# Altium schematic sheet SCH.schdoc
size 214 x 385 mm
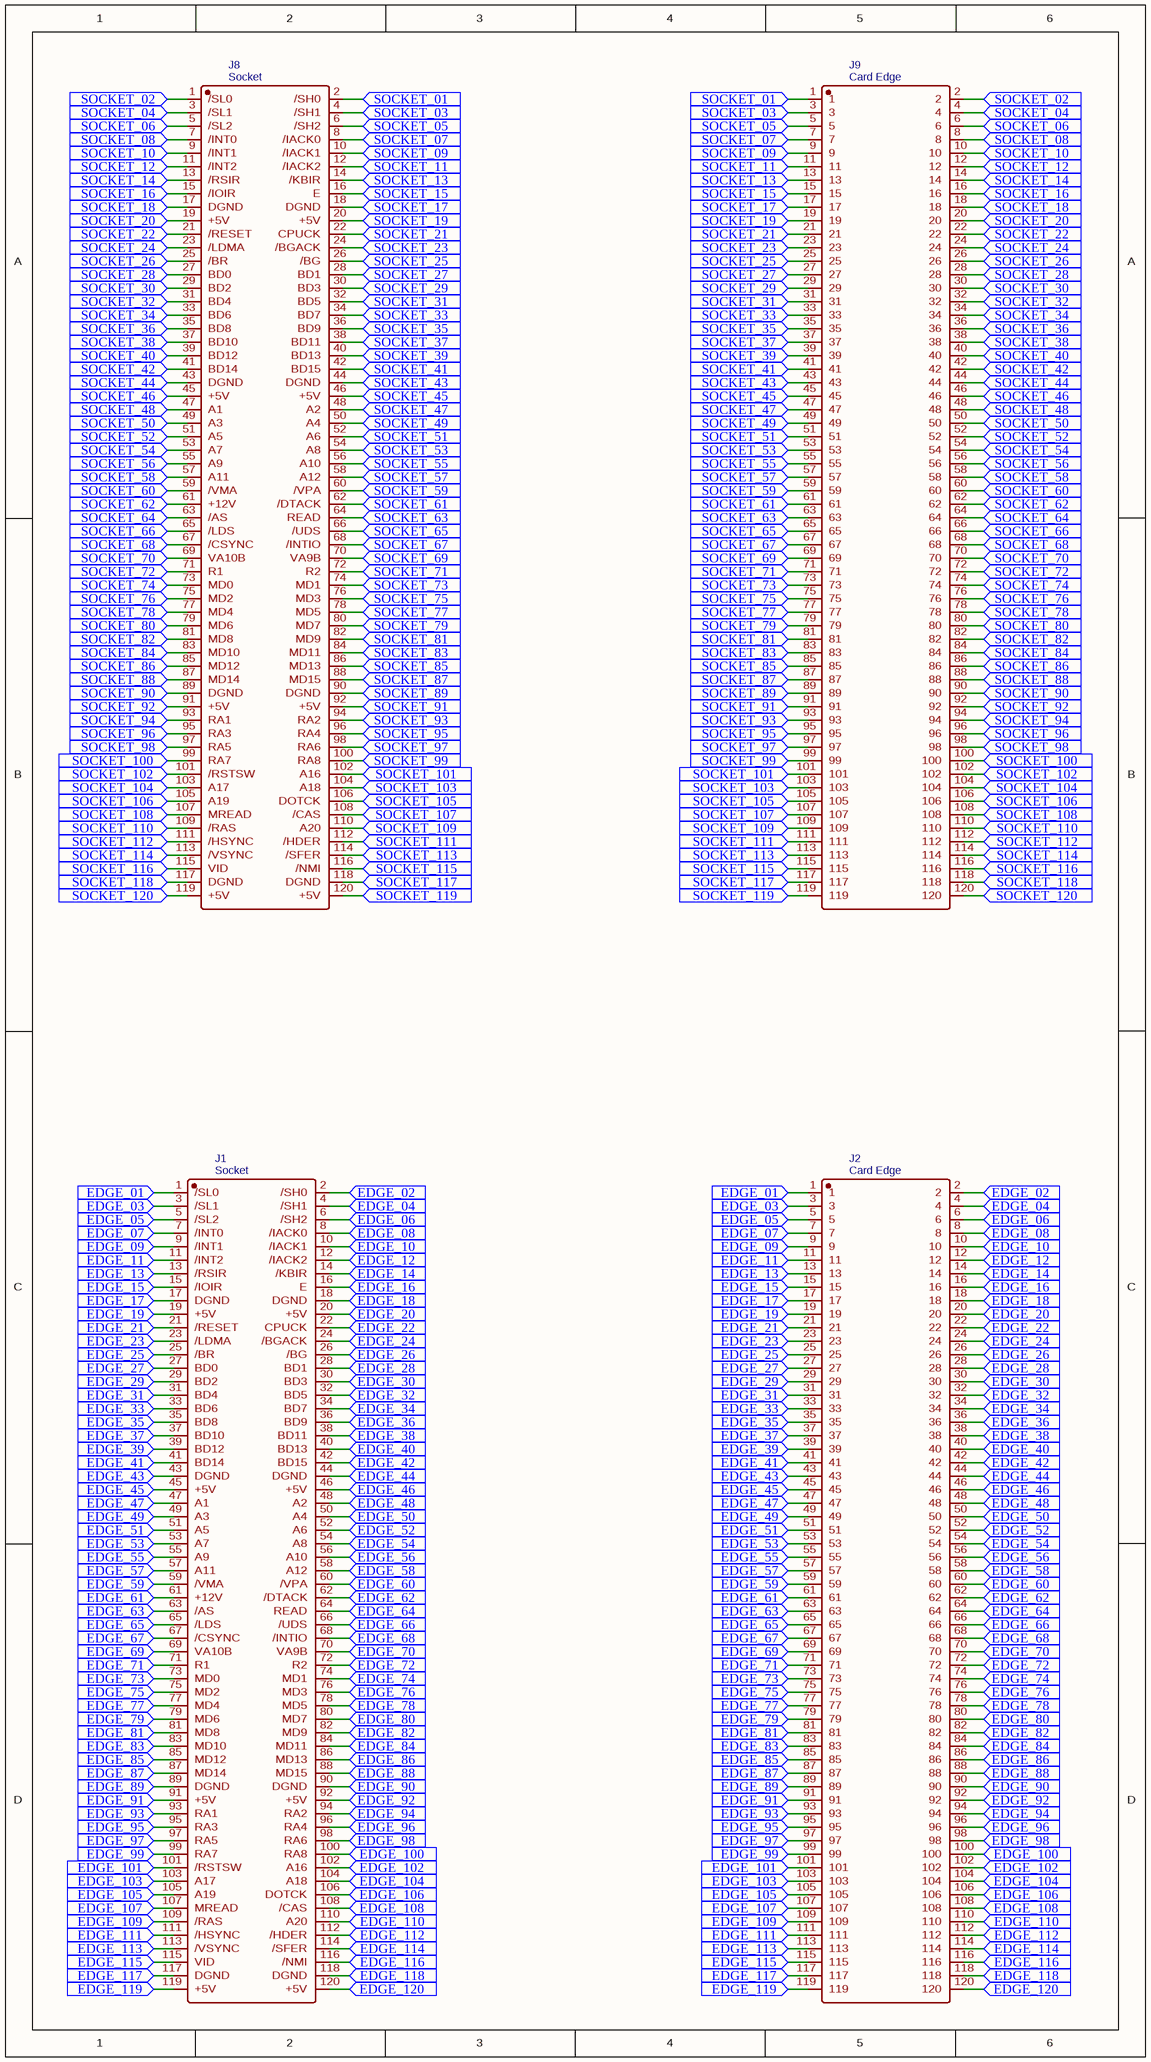
[diagram p0: SCH.schdoc]

## Parts
J1  Socket  [LISA-120]
J2  Card Edge  [I/O_EDGE_CONNECTOR]
J8  Socket  [LISA-120]
J9  Card Edge  [I/O_EDGE_CONNECTOR]

## Ports
EDGE_01 (in), EDGE_02 (in), EDGE_03 (in), EDGE_04 (in), EDGE_05 (in), EDGE_06 (in), EDGE_07 (in), EDGE_08 (in), EDGE_09 (in), EDGE_10 (in), EDGE_11 (in), EDGE_12 (in), EDGE_13 (in), EDGE_14 (in), EDGE_15 (in), EDGE_16 (in), EDGE_17 (in), EDGE_18 (in), EDGE_19 (in), EDGE_20 (in), EDGE_21 (in), EDGE_22 (in), EDGE_23 (in), EDGE_24 (in), EDGE_25 (in), EDGE_26 (in), EDGE_27 (in), EDGE_28 (in), EDGE_29 (in), EDGE_30 (in), EDGE_31 (in), EDGE_32 (in), EDGE_33 (in), EDGE_34 (in), EDGE_35 (in), EDGE_36 (in), EDGE_37 (in), EDGE_38 (in), EDGE_39 (in), EDGE_40 (in), EDGE_41 (in), EDGE_42 (in), EDGE_43 (in), EDGE_44 (in), EDGE_45 (in), EDGE_46 (in), EDGE_47 (in), EDGE_48 (in), EDGE_49 (in), EDGE_50 (in), EDGE_51 (in), EDGE_52 (in), EDGE_53 (in), EDGE_54 (in), EDGE_55 (in), EDGE_56 (in), EDGE_57 (in), EDGE_58 (in), EDGE_59 (in), EDGE_60 (in), EDGE_61 (in), EDGE_62 (in), EDGE_63 (in), EDGE_64 (in), EDGE_65 (in), EDGE_66 (in), EDGE_67 (in), EDGE_68 (in), EDGE_69 (in), EDGE_70 (in), EDGE_71 (in), EDGE_72 (in), EDGE_73 (in), EDGE_74 (in), EDGE_75 (in), EDGE_76 (in), EDGE_77 (in), EDGE_78 (in), EDGE_79 (in), EDGE_80 (in), EDGE_81 (in), EDGE_82 (in), EDGE_83 (in), EDGE_84 (in), EDGE_85 (in), EDGE_86 (in), EDGE_87 (in), EDGE_88 (in), EDGE_89 (in), EDGE_90 (in), EDGE_91 (in), EDGE_92 (in), EDGE_93 (in), EDGE_94 (in), EDGE_95 (in), EDGE_96 (in), EDGE_97 (in), EDGE_98 (in), EDGE_99 (in), EDGE_100 (in), EDGE_101 (in), EDGE_102 (in), EDGE_103 (in), EDGE_104 (in), EDGE_105 (in), EDGE_106 (in), EDGE_107 (in), EDGE_108 (in), EDGE_109 (in), EDGE_110 (in), EDGE_111 (in), EDGE_112 (in), EDGE_113 (in), EDGE_114 (in), EDGE_115 (in), EDGE_116 (in), EDGE_117 (in), EDGE_118 (in), EDGE_119 (in), EDGE_120 (in), SOCKET_01 (in), SOCKET_02 (in), SOCKET_03 (in), SOCKET_04 (in), SOCKET_05 (in), SOCKET_06 (in), SOCKET_07 (in), SOCKET_08 (in), SOCKET_09 (in), SOCKET_10 (in), SOCKET_11 (in), SOCKET_12 (in), SOCKET_13 (in), SOCKET_14 (in), SOCKET_15 (in), SOCKET_16 (in), SOCKET_17 (in), SOCKET_18 (in), SOCKET_19 (in), SOCKET_20 (in), SOCKET_21 (in), SOCKET_22 (in), SOCKET_23 (in), SOCKET_24 (in), SOCKET_25 (in), SOCKET_26 (in), SOCKET_27 (in), SOCKET_28 (in), SOCKET_29 (in), SOCKET_30 (in), SOCKET_31 (in), SOCKET_32 (in), SOCKET_33 (in), SOCKET_34 (in), SOCKET_35 (in), SOCKET_36 (in), SOCKET_37 (in), SOCKET_38 (in), SOCKET_39 (in), SOCKET_40 (in), SOCKET_41 (in), SOCKET_42 (in), SOCKET_43 (in), SOCKET_44 (in), SOCKET_45 (in), SOCKET_46 (in), SOCKET_47 (in), SOCKET_48 (in), SOCKET_49 (in), SOCKET_50 (in), SOCKET_51 (in), SOCKET_52 (in), SOCKET_53 (in), SOCKET_54 (in), SOCKET_55 (in), SOCKET_56 (in), SOCKET_57 (in), SOCKET_58 (in), SOCKET_59 (in), SOCKET_60 (in), SOCKET_61 (in), SOCKET_62 (in), SOCKET_63 (in), SOCKET_64 (in), SOCKET_65 (in), SOCKET_66 (in), SOCKET_67 (in), SOCKET_68 (in), SOCKET_69 (in), SOCKET_70 (in), SOCKET_71 (in), SOCKET_72 (in), SOCKET_73 (in), SOCKET_74 (in), SOCKET_75 (in), SOCKET_76 (in), SOCKET_77 (in), SOCKET_78 (in), SOCKET_79 (in), SOCKET_80 (in), SOCKET_81 (in), SOCKET_82 (in), SOCKET_83 (in), SOCKET_84 (in), SOCKET_85 (in), SOCKET_86 (in), SOCKET_87 (in), SOCKET_88 (in), SOCKET_89 (in), SOCKET_90 (in), SOCKET_91 (in), SOCKET_92 (in), SOCKET_93 (in), SOCKET_94 (in), SOCKET_95 (in), SOCKET_96 (in), SOCKET_97 (in), SOCKET_98 (in), SOCKET_99 (in), SOCKET_100 (in), SOCKET_101 (in), SOCKET_102 (in), SOCKET_103 (in), SOCKET_104 (in), SOCKET_105 (in), SOCKET_106 (in), SOCKET_107 (in), SOCKET_108 (in), SOCKET_109 (in), SOCKET_110 (in), SOCKET_111 (in), SOCKET_112 (in), SOCKET_113 (in), SOCKET_114 (in), SOCKET_115 (in), SOCKET_116 (in), SOCKET_117 (in), SOCKET_118 (in), SOCKET_119 (in), SOCKET_120 (in)

## Nets
EDGE_01: J1.1(/SL0) J2.1 ; port EDGE_01
EDGE_02: J1.2(/SH0) J2.2 ; port EDGE_02
EDGE_03: J1.3(/SL1) J2.3 ; port EDGE_03
EDGE_04: J1.4(/SH1) J2.4 ; port EDGE_04
EDGE_05: J1.5(/SL2) J2.5 ; port EDGE_05
EDGE_06: J1.6(/SH2) J2.6 ; port EDGE_06
EDGE_07: J1.7(/INT0) J2.7 ; port EDGE_07
EDGE_08: J1.8(/IACK0) J2.8 ; port EDGE_08
EDGE_09: J1.9(/INT1) J2.9 ; port EDGE_09
EDGE_10: J1.10(/IACK1) J2.10 ; port EDGE_10
EDGE_11: J1.11(/INT2) J2.11 ; port EDGE_11
EDGE_12: J1.12(/IACK2) J2.12 ; port EDGE_12
EDGE_13: J1.13(/RSIR) J2.13 ; port EDGE_13
EDGE_14: J1.14(/KBIR) J2.14 ; port EDGE_14
EDGE_15: J1.15(/IOIR) J2.15 ; port EDGE_15
EDGE_16: J1.16(E) J2.16 ; port EDGE_16
EDGE_17: J1.17(DGND) J2.17 ; port EDGE_17
EDGE_18: J1.18(DGND) J2.18 ; port EDGE_18
EDGE_19: J1.19(+5V) J2.19 ; port EDGE_19
EDGE_20: J1.20(+5V) J2.20 ; port EDGE_20
EDGE_21: J1.21(/RESET) J2.21 ; port EDGE_21
EDGE_22: J1.22(CPUCK) J2.22 ; port EDGE_22
EDGE_23: J1.23(/LDMA) J2.23 ; port EDGE_23
EDGE_24: J1.24(/BGACK) J2.24 ; port EDGE_24
EDGE_25: J1.25(/BR) J2.25 ; port EDGE_25
EDGE_26: J1.26(/BG) J2.26 ; port EDGE_26
EDGE_27: J1.27(BD0) J2.27 ; port EDGE_27
EDGE_28: J1.28(BD1) J2.28 ; port EDGE_28
EDGE_29: J1.29(BD2) J2.29 ; port EDGE_29
EDGE_30: J1.30(BD3) J2.30 ; port EDGE_30
EDGE_31: J1.31(BD4) J2.31 ; port EDGE_31
EDGE_32: J1.32(BD5) J2.32 ; port EDGE_32
EDGE_33: J1.33(BD6) J2.33 ; port EDGE_33
EDGE_34: J1.34(BD7) J2.34 ; port EDGE_34
EDGE_35: J1.35(BD8) J2.35 ; port EDGE_35
EDGE_36: J1.36(BD9) J2.36 ; port EDGE_36
EDGE_37: J1.37(BD10) J2.37 ; port EDGE_37
EDGE_38: J1.38(BD11) J2.38 ; port EDGE_38
EDGE_39: J1.39(BD12) J2.39 ; port EDGE_39
EDGE_40: J1.40(BD13) J2.40 ; port EDGE_40
EDGE_41: J1.41(BD14) J2.41 ; port EDGE_41
EDGE_42: J1.42(BD15) J2.42 ; port EDGE_42
EDGE_43: J1.43(DGND) J2.43 ; port EDGE_43
EDGE_44: J1.44(DGND) J2.44 ; port EDGE_44
EDGE_45: J1.45(+5V) J2.45 ; port EDGE_45
EDGE_46: J1.46(+5V) J2.46 ; port EDGE_46
EDGE_47: J1.47(A1) J2.47 ; port EDGE_47
EDGE_48: J1.48(A2) J2.48 ; port EDGE_48
EDGE_49: J1.49(A3) J2.49 ; port EDGE_49
EDGE_50: J1.50(A4) J2.50 ; port EDGE_50
EDGE_51: J1.51(A5) J2.51 ; port EDGE_51
EDGE_52: J1.52(A6) J2.52 ; port EDGE_52
EDGE_53: J1.53(A7) J2.53 ; port EDGE_53
EDGE_54: J1.54(A8) J2.54 ; port EDGE_54
EDGE_55: J1.55(A9) J2.55 ; port EDGE_55
EDGE_56: J1.56(A10) J2.56 ; port EDGE_56
EDGE_57: J1.57(A11) J2.57 ; port EDGE_57
EDGE_58: J1.58(A12) J2.58 ; port EDGE_58
EDGE_59: J1.59(/VMA) J2.59 ; port EDGE_59
EDGE_60: J1.60(/VPA) J2.60 ; port EDGE_60
EDGE_61: J1.61(+12V) J2.61 ; port EDGE_61
EDGE_62: J1.62(/DTACK) J2.62 ; port EDGE_62
EDGE_63: J1.63(/AS) J2.63 ; port EDGE_63
EDGE_64: J1.64(READ) J2.64 ; port EDGE_64
EDGE_65: J1.65(/LDS) J2.65 ; port EDGE_65
EDGE_66: J1.66(/UDS) J2.66 ; port EDGE_66
EDGE_67: J1.67(/CSYNC) J2.67 ; port EDGE_67
EDGE_68: J1.68(/INTIO) J2.68 ; port EDGE_68
EDGE_69: J1.69(VA10B) J2.69 ; port EDGE_69
EDGE_70: J1.70(VA9B) J2.70 ; port EDGE_70
EDGE_71: J1.71(R1) J2.71 ; port EDGE_71
EDGE_72: J1.72(R2) J2.72 ; port EDGE_72
EDGE_73: J1.73(MD0) J2.73 ; port EDGE_73
EDGE_74: J1.74(MD1) J2.74 ; port EDGE_74
EDGE_75: J1.75(MD2) J2.75 ; port EDGE_75
EDGE_76: J1.76(MD3) J2.76 ; port EDGE_76
EDGE_77: J1.77(MD4) J2.77 ; port EDGE_77
EDGE_78: J1.78(MD5) J2.78 ; port EDGE_78
EDGE_79: J1.79(MD6) J2.79 ; port EDGE_79
EDGE_80: J1.80(MD7) J2.80 ; port EDGE_80
EDGE_81: J1.81(MD8) J2.81 ; port EDGE_81
EDGE_82: J1.82(MD9) J2.82 ; port EDGE_82
EDGE_83: J1.83(MD10) J2.83 ; port EDGE_83
EDGE_84: J1.84(MD11) J2.84 ; port EDGE_84
EDGE_85: J1.85(MD12) J2.85 ; port EDGE_85
EDGE_86: J1.86(MD13) J2.86 ; port EDGE_86
EDGE_87: J1.87(MD14) J2.87 ; port EDGE_87
EDGE_88: J1.88(MD15) J2.88 ; port EDGE_88
EDGE_89: J1.89(DGND) J2.89 ; port EDGE_89
EDGE_90: J1.90(DGND) J2.90 ; port EDGE_90
EDGE_91: J1.91(+5V) J2.91 ; port EDGE_91
EDGE_92: J1.92(+5V) J2.92 ; port EDGE_92
EDGE_93: J1.93(RA1) J2.93 ; port EDGE_93
EDGE_94: J1.94(RA2) J2.94 ; port EDGE_94
EDGE_95: J1.95(RA3) J2.95 ; port EDGE_95
EDGE_96: J1.96(RA4) J2.96 ; port EDGE_96
EDGE_97: J1.97(RA5) J2.97 ; port EDGE_97
EDGE_98: J1.98(RA6) J2.98 ; port EDGE_98
EDGE_99: J1.99(RA7) J2.99 ; port EDGE_99
EDGE_100: J1.100(RA8) J2.100 ; port EDGE_100
EDGE_101: J1.101(/RSTSW) J2.101 ; port EDGE_101
EDGE_102: J1.102(A16) J2.102 ; port EDGE_102
EDGE_103: J1.103(A17) J2.103 ; port EDGE_103
EDGE_104: J1.104(A18) J2.104 ; port EDGE_104
EDGE_105: J1.105(A19) J2.105 ; port EDGE_105
EDGE_106: J1.106(DOTCK) J2.106 ; port EDGE_106
EDGE_107: J1.107(MREAD) J2.107 ; port EDGE_107
EDGE_108: J1.108(/CAS) J2.108 ; port EDGE_108
EDGE_109: J1.109(/RAS) J2.109 ; port EDGE_109
EDGE_110: J1.110(A20) J2.110 ; port EDGE_110
EDGE_111: J1.111(/HSYNC) J2.111 ; port EDGE_111
EDGE_112: J1.112(/HDER) J2.112 ; port EDGE_112
EDGE_113: J1.113(/VSYNC) J2.113 ; port EDGE_113
EDGE_114: J1.114(/SFER) J2.114 ; port EDGE_114
EDGE_115: J1.115(VID) J2.115 ; port EDGE_115
EDGE_116: J1.116(/NMI) J2.116 ; port EDGE_116
EDGE_117: J1.117(DGND) J2.117 ; port EDGE_117
EDGE_118: J1.118(DGND) J2.118 ; port EDGE_118
EDGE_119: J1.119(+5V) J2.119 ; port EDGE_119
EDGE_120: J1.120(+5V) J2.120 ; port EDGE_120
SOCKET_01: J8.2(/SH0) J9.1 ; port SOCKET_01
SOCKET_02: J8.1(/SL0) J9.2 ; port SOCKET_02
SOCKET_03: J8.4(/SH1) J9.3 ; port SOCKET_03
SOCKET_04: J8.3(/SL1) J9.4 ; port SOCKET_04
SOCKET_05: J8.6(/SH2) J9.5 ; port SOCKET_05
SOCKET_06: J8.5(/SL2) J9.6 ; port SOCKET_06
SOCKET_07: J8.8(/IACK0) J9.7 ; port SOCKET_07
SOCKET_08: J8.7(/INT0) J9.8 ; port SOCKET_08
SOCKET_09: J8.10(/IACK1) J9.9 ; port SOCKET_09
SOCKET_10: J8.9(/INT1) J9.10 ; port SOCKET_10
SOCKET_11: J8.12(/IACK2) J9.11 ; port SOCKET_11
SOCKET_12: J8.11(/INT2) J9.12 ; port SOCKET_12
SOCKET_13: J8.14(/KBIR) J9.13 ; port SOCKET_13
SOCKET_14: J8.13(/RSIR) J9.14 ; port SOCKET_14
SOCKET_15: J8.16(E) J9.15 ; port SOCKET_15
SOCKET_16: J8.15(/IOIR) J9.16 ; port SOCKET_16
SOCKET_17: J8.18(DGND) J9.17 ; port SOCKET_17
SOCKET_18: J8.17(DGND) J9.18 ; port SOCKET_18
SOCKET_19: J8.20(+5V) J9.19 ; port SOCKET_19
SOCKET_20: J8.19(+5V) J9.20 ; port SOCKET_20
SOCKET_21: J8.22(CPUCK) J9.21 ; port SOCKET_21
SOCKET_22: J8.21(/RESET) J9.22 ; port SOCKET_22
SOCKET_23: J8.24(/BGACK) J9.23 ; port SOCKET_23
SOCKET_24: J8.23(/LDMA) J9.24 ; port SOCKET_24
SOCKET_25: J8.26(/BG) J9.25 ; port SOCKET_25
SOCKET_26: J8.25(/BR) J9.26 ; port SOCKET_26
SOCKET_27: J8.28(BD1) J9.27 ; port SOCKET_27
SOCKET_28: J8.27(BD0) J9.28 ; port SOCKET_28
SOCKET_29: J8.30(BD3) J9.29 ; port SOCKET_29
SOCKET_30: J8.29(BD2) J9.30 ; port SOCKET_30
SOCKET_31: J8.32(BD5) J9.31 ; port SOCKET_31
SOCKET_32: J8.31(BD4) J9.32 ; port SOCKET_32
SOCKET_33: J8.34(BD7) J9.33 ; port SOCKET_33
SOCKET_34: J8.33(BD6) J9.34 ; port SOCKET_34
SOCKET_35: J8.36(BD9) J9.35 ; port SOCKET_35
SOCKET_36: J8.35(BD8) J9.36 ; port SOCKET_36
SOCKET_37: J8.38(BD11) J9.37 ; port SOCKET_37
SOCKET_38: J8.37(BD10) J9.38 ; port SOCKET_38
SOCKET_39: J8.40(BD13) J9.39 ; port SOCKET_39
SOCKET_40: J8.39(BD12) J9.40 ; port SOCKET_40
SOCKET_41: J8.42(BD15) J9.41 ; port SOCKET_41
SOCKET_42: J8.41(BD14) J9.42 ; port SOCKET_42
SOCKET_43: J8.44(DGND) J9.43 ; port SOCKET_43
SOCKET_44: J8.43(DGND) J9.44 ; port SOCKET_44
SOCKET_45: J8.46(+5V) J9.45 ; port SOCKET_45
SOCKET_46: J8.45(+5V) J9.46 ; port SOCKET_46
SOCKET_47: J8.48(A2) J9.47 ; port SOCKET_47
SOCKET_48: J8.47(A1) J9.48 ; port SOCKET_48
SOCKET_49: J8.50(A4) J9.49 ; port SOCKET_49
SOCKET_50: J8.49(A3) J9.50 ; port SOCKET_50
SOCKET_51: J8.52(A6) J9.51 ; port SOCKET_51
SOCKET_52: J8.51(A5) J9.52 ; port SOCKET_52
SOCKET_53: J8.54(A8) J9.53 ; port SOCKET_53
SOCKET_54: J8.53(A7) J9.54 ; port SOCKET_54
SOCKET_55: J8.56(A10) J9.55 ; port SOCKET_55
SOCKET_56: J8.55(A9) J9.56 ; port SOCKET_56
SOCKET_57: J8.58(A12) J9.57 ; port SOCKET_57
SOCKET_58: J8.57(A11) J9.58 ; port SOCKET_58
SOCKET_59: J8.60(/VPA) J9.59 ; port SOCKET_59
SOCKET_60: J8.59(/VMA) J9.60 ; port SOCKET_60
SOCKET_61: J8.62(/DTACK) J9.61 ; port SOCKET_61
SOCKET_62: J8.61(+12V) J9.62 ; port SOCKET_62
SOCKET_63: J8.64(READ) J9.63 ; port SOCKET_63
SOCKET_64: J8.63(/AS) J9.64 ; port SOCKET_64
SOCKET_65: J8.66(/UDS) J9.65 ; port SOCKET_65
SOCKET_66: J8.65(/LDS) J9.66 ; port SOCKET_66
SOCKET_67: J8.68(/INTIO) J9.67 ; port SOCKET_67
SOCKET_68: J8.67(/CSYNC) J9.68 ; port SOCKET_68
SOCKET_69: J8.70(VA9B) J9.69 ; port SOCKET_69
SOCKET_70: J8.69(VA10B) J9.70 ; port SOCKET_70
SOCKET_71: J8.72(R2) J9.71 ; port SOCKET_71
SOCKET_72: J8.71(R1) J9.72 ; port SOCKET_72
SOCKET_73: J8.74(MD1) J9.73 ; port SOCKET_73
SOCKET_74: J8.73(MD0) J9.74 ; port SOCKET_74
SOCKET_75: J8.76(MD3) J9.75 ; port SOCKET_75
SOCKET_76: J8.75(MD2) J9.76 ; port SOCKET_76
SOCKET_77: J8.78(MD5) J9.77 ; port SOCKET_77
SOCKET_78: J8.77(MD4) J9.78 ; port SOCKET_78
SOCKET_79: J8.80(MD7) J9.79 ; port SOCKET_79
SOCKET_80: J8.79(MD6) J9.80 ; port SOCKET_80
SOCKET_81: J8.82(MD9) J9.81 ; port SOCKET_81
SOCKET_82: J8.81(MD8) J9.82 ; port SOCKET_82
SOCKET_83: J8.84(MD11) J9.83 ; port SOCKET_83
SOCKET_84: J8.83(MD10) J9.84 ; port SOCKET_84
SOCKET_85: J8.86(MD13) J9.85 ; port SOCKET_85
SOCKET_86: J8.85(MD12) J9.86 ; port SOCKET_86
SOCKET_87: J8.88(MD15) J9.87 ; port SOCKET_87
SOCKET_88: J8.87(MD14) J9.88 ; port SOCKET_88
SOCKET_89: J8.90(DGND) J9.89 ; port SOCKET_89
SOCKET_90: J8.89(DGND) J9.90 ; port SOCKET_90
SOCKET_91: J8.92(+5V) J9.91 ; port SOCKET_91
SOCKET_92: J8.91(+5V) J9.92 ; port SOCKET_92
SOCKET_93: J8.94(RA2) J9.93 ; port SOCKET_93
SOCKET_94: J8.93(RA1) J9.94 ; port SOCKET_94
SOCKET_95: J8.96(RA4) J9.95 ; port SOCKET_95
SOCKET_96: J8.95(RA3) J9.96 ; port SOCKET_96
SOCKET_97: J8.98(RA6) J9.97 ; port SOCKET_97
SOCKET_98: J8.97(RA5) J9.98 ; port SOCKET_98
SOCKET_99: J8.100(RA8) J9.99 ; port SOCKET_99
SOCKET_100: J8.99(RA7) J9.100 ; port SOCKET_100
SOCKET_101: J8.102(A16) J9.101 ; port SOCKET_101
SOCKET_102: J8.101(/RSTSW) J9.102 ; port SOCKET_102
SOCKET_103: J8.104(A18) J9.103 ; port SOCKET_103
SOCKET_104: J8.103(A17) J9.104 ; port SOCKET_104
SOCKET_105: J8.106(DOTCK) J9.105 ; port SOCKET_105
SOCKET_106: J8.105(A19) J9.106 ; port SOCKET_106
SOCKET_107: J8.108(/CAS) J9.107 ; port SOCKET_107
SOCKET_108: J8.107(MREAD) J9.108 ; port SOCKET_108
SOCKET_109: J8.110(A20) J9.109 ; port SOCKET_109
SOCKET_110: J8.109(/RAS) J9.110 ; port SOCKET_110
SOCKET_111: J8.112(/HDER) J9.111 ; port SOCKET_111
SOCKET_112: J8.111(/HSYNC) J9.112 ; port SOCKET_112
SOCKET_113: J8.114(/SFER) J9.113 ; port SOCKET_113
SOCKET_114: J8.113(/VSYNC) J9.114 ; port SOCKET_114
SOCKET_115: J8.116(/NMI) J9.115 ; port SOCKET_115
SOCKET_116: J8.115(VID) J9.116 ; port SOCKET_116
SOCKET_117: J8.118(DGND) J9.117 ; port SOCKET_117
SOCKET_118: J8.117(DGND) J9.118 ; port SOCKET_118
SOCKET_119: J8.120(+5V) J9.119 ; port SOCKET_119
SOCKET_120: J8.119(+5V) J9.120 ; port SOCKET_120

## Library data of the parts
J1 J8 = Socket: BOM_Manufacturer: EDAC; BOM_Manufacturer Part: 345-120-520-201; Contributor: AlexTheCat123; BOM_Supplier: Mouser; BOM_Supplier Part: 587-345-120-520-201; spicePre: J; spiceSymbolName: Apple Lisa 120-Pin Edge Connector
J2 J9 = Card Edge: BOM_Manufacturer: EDAC; BOM_Manufacturer Part: 345-120-520-201; Contributor: AlexTheCat123; BOM_Supplier: Mouser; BOM_Supplier Part: 587-345-120-520-201; spicePre: J; spiceSymbolName: Apple Lisa 120-Pin Edge Connector